# Altium schematic sheet Power_Supply.SchDoc
size A4; Author: Wojciech Grędel; Revision: 1
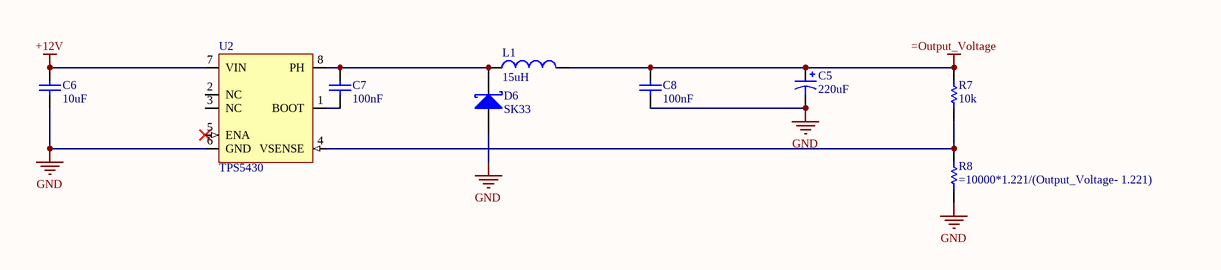
[diagram p0: Power_Supply.SchDoc]

## Parts
C5  value 220uF  [CAP_SMD_D_IPC_MD]  (hidden comment: Cap Pol)
C6  value 10uF  [CAP_0805_IPC_MD]  (hidden comment: Cap)
C7  value 100nF  [CAP_0805_IPC_MD]  (hidden comment: Cap)
C8  value 100nF  [CAP_0805_IPC_MD]  (hidden comment: Cap)
D6  SK33  [DO214AB_IPC_MD]
L1  value 15uH  [DL50]  (hidden comment: Inductor)
R7  value 10k  [RES_0805_IPC_MD]  (hidden comment: Res)
R8  Res  [RES_0805_IPC_MD]  (value not drawn)
U2  TPS5430  [SOIC_8_THERMAL_PAD_IPC_MD]

## Nets
6: U2.9(PwPd)
+12V: C6.2 U2.7(VIN)
=Output_Voltage: C5.1 C8.2 L1.2 R7.2
GND: C5.2 C6.1 C8.1 D6.1(A) R8.1 U2.6(GND)
NetC7_1: C7.1 U2.1(BOOT)
NetC7_2: C7.2 D6.2(K) L1.1 U2.8(PH)
NetR7_1: R7.1 R8.2 U2.4(VSENSE)

Not connected (* = marked no-connect by the designer): U2 2(NC) 3(NC) 5(ENA)*

## Notes on the sheet
- Confidential / Not for distribution !
- Project name:
- Document name:
- Designer Name:
- Date/Time:
- Revision:

## Library data of the parts
C5 = Cap Pol: Polarized Capacitor (Axial); Published: 8-Jun-2000; LatestRevisionDate: 17-Jul-2002; LatestRevisionNote: Re-released for DXP Platform.; PackageReference: POLAR0.8; Publisher: Altium Limited; PackageDescription: Polarized Capacitor; 2 Leads; Supplier: TME; Supplier Part Number: TPSD227K010R0050
C6 = Cap: Capacitor; Manufacutrer: Sansung; Supplier Part Number: CL21A106KOQNNNF; Supplier: TME
C7 C8 = Cap: Capacitor; Manufacutrer: Samsung; Supplier Part Number: CL21B104KBCNNNC; Supplier: TME
D6 = SK33: Schottky Diode; Manufacturer: Diotec; ManufacturerURL: http://diotec.com/tl_files/diotec/files/pdf/datasheets/sk32; Supplier 1: TME; Supplier Part Number 1: SK33-DIO; ManufacturerName: SK33
L1 = Inductor: Manufacturer: Ferrocore; Isat: 8A; Irms: 4A; Supplier: TME; Supplier Part Number: DL50-15
R7 R8 = Res: Resistor; Manufacturer: Royal Ohm; Supplier: TME; Supplier Part Number: SMD0805-0R
  R8: Value: =10000*1.221/(Output_Voltage- 1.221)
U2 = TPS5430: 3-A, Wide Input Range, Step-Down Converter; Manufacturer: Texas Instruments; Supplier: TME; Supplier Part Number: TPS5430DDAR